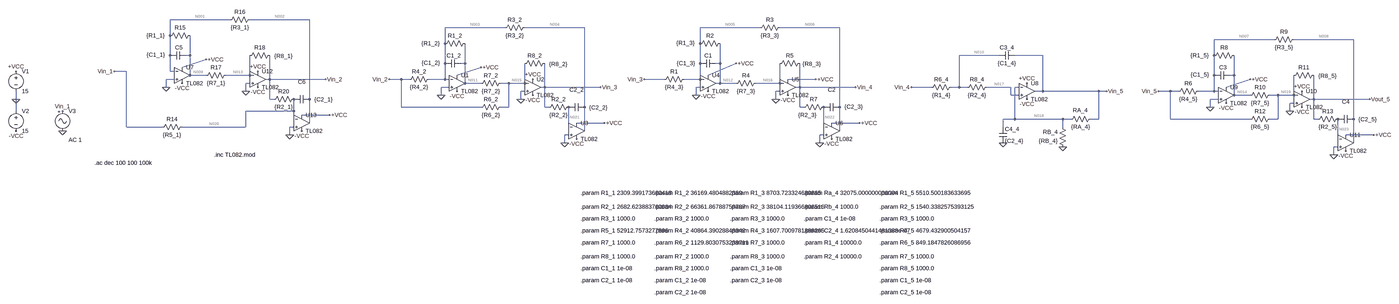
[diagram p0: schematic simulation_generated_20191112-203857.asc, whole sheet]
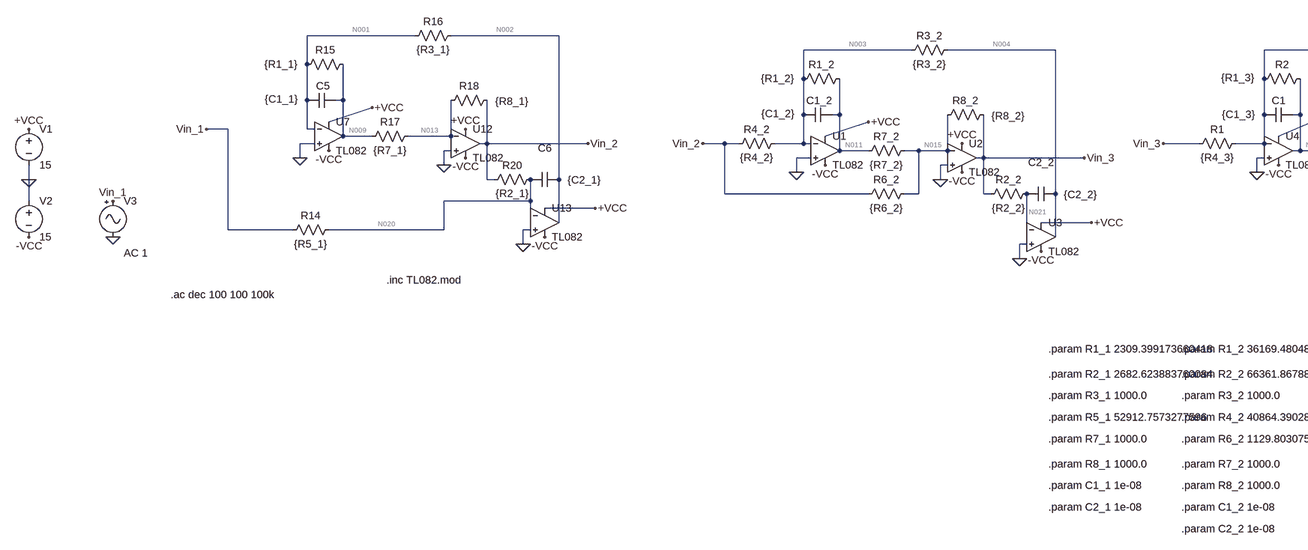
[diagram p1: schematic simulation_generated_20191112-203857.asc, part, row 1 of 1, column 1 of 2]
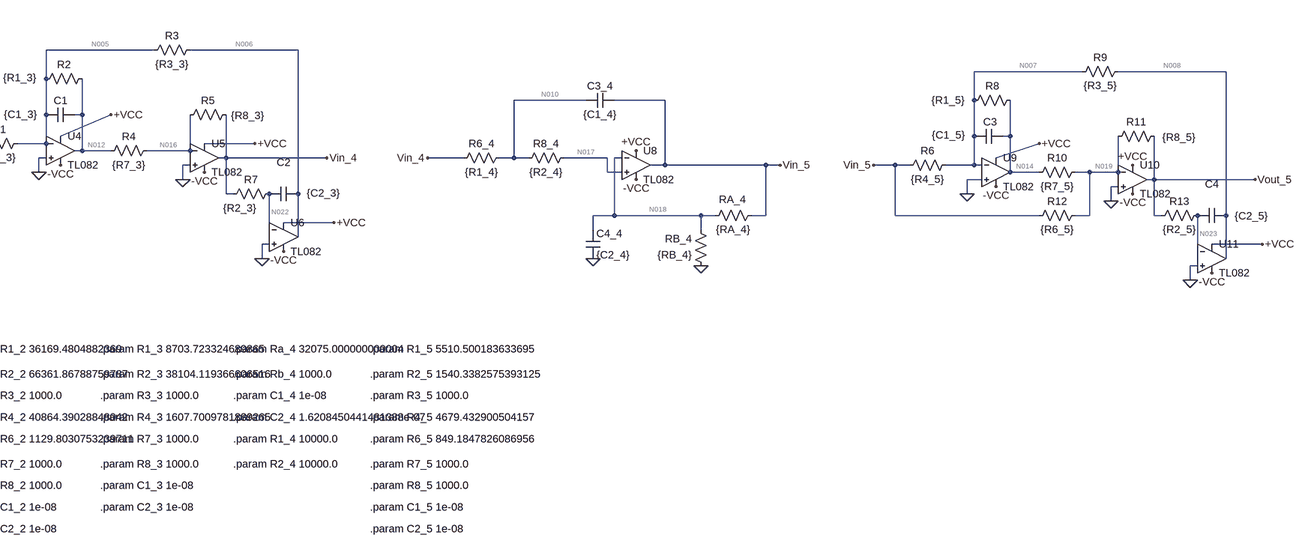
[diagram p2: schematic simulation_generated_20191112-203857.asc, part, row 1 of 1, column 2 of 2]
simulation_generated_20191112-203857.asc, the LTspice schematic file:
Version 4
SHEET 1 3956 1200
WIRE -768 -16 -1008 -16
WIRE -448 -16 -688 -16
WIRE 384 16 144 16
WIRE 704 16 464 16
WIRE 1408 16 1168 16
WIRE 1728 16 1488 16
WIRE -1008 48 -1008 -16
WIRE 3472 64 3232 64
WIRE 3792 64 3552 64
WIRE 144 80 144 16
WIRE 1168 80 1168 16
WIRE -1008 128 -1008 48
WIRE -928 128 -928 48
WIRE -928 128 -944 128
WIRE 2368 128 2208 128
WIRE 2544 128 2432 128
WIRE 3232 128 3232 64
WIRE 144 160 144 80
WIRE 224 160 224 80
WIRE 224 160 208 160
WIRE 1168 160 1168 80
WIRE 1248 160 1248 80
WIRE 1248 160 1232 160
WIRE -960 176 -864 144
WIRE -1184 192 -1232 192
WIRE -1008 192 -1008 128
WIRE -992 192 -1008 192
WIRE -928 208 -928 128
WIRE -864 208 -928 208
WIRE -688 208 -688 128
WIRE -688 208 -784 208
WIRE 192 208 288 176
WIRE 1200 208 1312 160
WIRE 3232 208 3232 128
WIRE 3312 208 3312 128
WIRE 3312 208 3296 208
WIRE -992 224 -1024 224
WIRE -608 224 -608 128
WIRE -608 224 -624 224
WIRE -384 224 -608 224
WIRE -32 224 -80 224
WIRE 0 224 -32 224
WIRE 144 224 144 160
WIRE 144 224 80 224
WIRE 160 224 144 224
WIRE 1024 224 944 224
WIRE 1168 224 1168 160
WIRE 1168 224 1104 224
WIRE 1632 224 1520 224
WIRE -688 240 -704 240
WIRE 224 240 224 160
WIRE 288 240 224 240
WIRE 400 240 368 240
WIRE 464 240 464 160
WIRE 464 240 400 240
WIRE 1248 240 1248 160
WIRE 1248 240 1232 240
WIRE 1312 240 1248 240
WIRE 1488 240 1488 160
WIRE 1488 240 1392 240
WIRE -1024 256 -1024 224
WIRE 160 256 128 256
WIRE 544 256 544 160
WIRE 544 256 528 256
WIRE 768 256 544 256
WIRE 1168 256 1152 256
WIRE 1568 256 1568 160
WIRE 1568 256 1552 256
WIRE 1792 256 1568 256
WIRE 2096 256 2016 256
WIRE 2208 256 2208 128
WIRE 2208 256 2176 256
WIRE 2240 256 2208 256
WIRE 2416 256 2320 256
WIRE 2448 256 2432 256
WIRE 3280 256 3376 224
WIRE -704 272 -704 240
WIRE 464 272 448 272
WIRE 1488 272 1472 272
WIRE 2544 272 2544 128
WIRE 2544 272 2512 272
WIRE 2768 272 2544 272
WIRE 2800 272 2768 272
WIRE 3056 272 3008 272
WIRE 3088 272 3056 272
WIRE 3232 272 3232 208
WIRE 3232 272 3168 272
WIRE 3248 272 3232 272
WIRE 128 288 128 256
WIRE 1152 288 1152 256
WIRE 2416 288 2416 256
WIRE 2448 288 2416 288
WIRE 3312 288 3312 208
WIRE 3376 288 3312 288
WIRE 3488 288 3456 288
WIRE 3552 288 3552 208
WIRE 3552 288 3488 288
WIRE -1792 304 -1792 272
WIRE -608 304 -608 224
WIRE -592 304 -608 304
WIRE -448 304 -448 -16
WIRE 448 304 448 272
WIRE 1472 304 1472 272
WIRE 3248 304 3216 304
WIRE 3632 304 3632 208
WIRE 3632 304 3616 304
WIRE 3856 304 3632 304
WIRE 3552 320 3536 320
WIRE -32 336 -32 224
WIRE 288 336 -32 336
WIRE 400 336 400 240
WIRE 400 336 368 336
WIRE 544 336 544 256
WIRE 560 336 544 336
WIRE 704 336 704 16
WIRE 1568 336 1568 256
WIRE 1584 336 1568 336
WIRE 1728 336 1728 16
WIRE 3216 336 3216 304
WIRE -1792 352 -1792 304
WIRE -512 352 -512 304
WIRE -512 352 -704 352
WIRE 3536 352 3536 320
WIRE -368 368 -480 368
WIRE -512 384 -512 352
WIRE 2432 384 2432 256
WIRE 2432 384 2384 384
WIRE 2624 384 2432 384
WIRE 2656 384 2624 384
WIRE 2768 384 2768 272
WIRE 2768 384 2736 384
WIRE 3056 384 3056 272
WIRE 3376 384 3056 384
WIRE 3488 384 3488 288
WIRE 3488 384 3456 384
WIRE 3632 384 3632 304
WIRE 3648 384 3632 384
WIRE 3792 384 3792 64
WIRE -448 400 -448 304
WIRE 784 400 672 400
WIRE 1808 400 1696 400
WIRE -1184 416 -1184 192
WIRE -1040 416 -1184 416
WIRE -704 416 -704 352
WIRE -704 416 -960 416
WIRE -512 416 -528 416
WIRE 640 416 640 336
WIRE 1664 416 1664 336
WIRE 2384 416 2384 384
WIRE 2624 416 2624 384
WIRE 704 432 704 336
WIRE 1728 432 1728 336
WIRE -528 448 -528 416
WIRE 640 448 624 448
WIRE 1664 448 1648 448
WIRE 3872 448 3760 448
WIRE 3728 464 3728 384
WIRE 624 480 624 448
WIRE 1648 480 1648 448
WIRE 3792 480 3792 384
WIRE 3728 496 3712 496
WIRE 3712 528 3712 496
FLAG 128 288 0
FLAG 448 304 0
FLAG 624 480 0
FLAG -80 224 Vin_2
FLAG 768 256 Vin_3
FLAG 1152 288 0
FLAG 1472 304 0
FLAG 1648 480 0
FLAG 944 224 Vin_3
FLAG 1792 256 Vin_4
FLAG 288 176 +VCC
FLAG 192 272 -VCC
FLAG 496 224 +VCC
FLAG 496 288 -VCC
FLAG 784 400 +VCC
FLAG 672 464 -VCC
FLAG 2384 480 0
FLAG 2624 496 0
FLAG 2480 240 +VCC
FLAG 2480 304 -VCC
FLAG 2016 256 Vin_4
FLAG 2800 272 Vin_5
FLAG 1312 160 +VCC
FLAG 1200 272 -VCC
FLAG 1632 224 +VCC
FLAG 1520 288 -VCC
FLAG 1808 400 +VCC
FLAG 1696 464 -VCC
FLAG 3216 336 0
FLAG 3536 352 0
FLAG 3712 528 0
FLAG 3008 272 Vin_5
FLAG 3856 304 Vout_5
FLAG 3376 224 +VCC
FLAG 3280 320 -VCC
FLAG 3584 272 +VCC
FLAG 3584 336 -VCC
FLAG 3872 448 +VCC
FLAG 3760 512 -VCC
FLAG -1024 256 0
FLAG -704 272 0
FLAG -528 448 0
FLAG -1232 192 Vin_1
FLAG -384 224 Vin_2
FLAG -864 144 +VCC
FLAG -960 240 -VCC
FLAG -656 192 +VCC
FLAG -656 256 -VCC
FLAG -368 368 +VCC
FLAG -480 432 -VCC
FLAG -1792 304 0
FLAG -1792 192 +VCC
FLAG -1792 432 -VCC
FLAG -1440 432 0
FLAG -1440 352 Vin_1
SYMBOL res 96 208 R90
WINDOW 0 0 56 VBottom 2
WINDOW 3 32 56 VTop 2
SYMATTR InstName R4_2
SYMATTR Value {R4_2}
SYMBOL res 240 64 R90
WINDOW 0 0 56 VBottom 2
WINDOW 3 0 154 VTop 2
SYMATTR InstName R1_2
SYMATTR Value {R1_2}
SYMBOL cap 208 144 R90
WINDOW 0 0 29 VBottom 2
WINDOW 3 -2 121 VTop 2
SYMATTR InstName C1_2
SYMATTR Value {C1_2}
SYMBOL res 480 0 R90
WINDOW 0 0 56 VBottom 2
WINDOW 3 32 56 VTop 2
SYMATTR InstName R3_2
SYMATTR Value {R3_2}
SYMBOL res 384 224 R90
WINDOW 0 0 56 VBottom 2
WINDOW 3 32 56 VTop 2
SYMATTR InstName R7_2
SYMATTR Value {R7_2}
SYMBOL res 560 144 R90
WINDOW 0 0 56 VBottom 2
WINDOW 3 3 -39 VTop 2
SYMATTR InstName R8_2
SYMATTR Value {R8_2}
SYMBOL res 384 320 R90
WINDOW 0 0 56 VBottom 2
WINDOW 3 32 56 VTop 2
SYMATTR InstName R6_2
SYMATTR Value {R6_2}
SYMBOL cap 704 320 R90
WINDOW 0 -38 32 VBottom 2
WINDOW 3 2 -56 VTop 2
SYMATTR InstName C2_2
SYMATTR Value {C2_2}
SYMBOL res 656 320 R90
WINDOW 0 0 56 VBottom 2
WINDOW 3 32 56 VTop 2
SYMATTR InstName R2_2
SYMATTR Value {R2_2}
SYMBOL res 1120 208 R90
WINDOW 0 0 56 VBottom 2
WINDOW 3 32 56 VTop 2
SYMATTR InstName R1
SYMATTR Value {R4_3}
SYMBOL res 1264 64 R90
WINDOW 0 0 56 VBottom 2
WINDOW 3 -2 154 VTop 2
SYMATTR InstName R2
SYMATTR Value {R1_3}
SYMBOL cap 1232 144 R90
WINDOW 0 0 32 VBottom 2
WINDOW 3 0 121 VTop 2
SYMATTR InstName C1
SYMATTR Value {C1_3}
SYMBOL res 1504 0 R90
WINDOW 0 0 56 VBottom 2
WINDOW 3 32 56 VTop 2
SYMATTR InstName R3
SYMATTR Value {R3_3}
SYMBOL res 1408 224 R90
WINDOW 0 0 56 VBottom 2
WINDOW 3 32 56 VTop 2
SYMATTR InstName R4
SYMATTR Value {R7_3}
SYMBOL res 1584 144 R90
WINDOW 0 0 56 VBottom 2
WINDOW 3 2 -32 VTop 2
SYMATTR InstName R5
SYMATTR Value {R8_3}
SYMBOL cap 1728 320 R90
WINDOW 0 -38 32 VBottom 2
WINDOW 3 -1 -57 VTop 2
SYMATTR InstName C2
SYMATTR Value {C2_3}
SYMBOL res 1680 320 R90
WINDOW 0 0 56 VBottom 2
WINDOW 3 32 81 VTop 2
SYMATTR InstName R7
SYMATTR Value {R2_3}
SYMBOL Opamps\\opamp2 192 176 R0
SYMATTR InstName U1
SYMATTR Value TL082
SYMBOL Opamps\\opamp2 496 192 R0
SYMATTR InstName U2
SYMATTR Value TL082
SYMBOL Opamps\\opamp2 672 368 R0
SYMATTR InstName U3
SYMATTR Value TL082
SYMBOL res 2192 240 R90
WINDOW 0 0 56 VBottom 2
WINDOW 3 32 56 VTop 2
SYMATTR InstName R6_4
SYMATTR Value {R1_4}
SYMBOL res 2336 240 R90
WINDOW 0 0 56 VBottom 2
WINDOW 3 32 56 VTop 2
SYMATTR InstName R8_4
SYMATTR Value {R2_4}
SYMBOL cap 2432 112 R90
WINDOW 0 0 32 VBottom 2
WINDOW 3 32 32 VTop 2
SYMATTR InstName C3_4
SYMATTR Value {C1_4}
SYMBOL res 2640 512 R180
WINDOW 0 36 76 Left 2
WINDOW 3 36 40 Left 2
SYMATTR InstName RB_4
SYMATTR Value {RB_4}
SYMBOL res 2752 368 R90
WINDOW 0 -4 58 VBottom 2
WINDOW 3 32 56 VTop 2
SYMATTR InstName RA_4
SYMATTR Value {RA_4}
SYMBOL cap 2368 416 R0
SYMATTR InstName C4_4
SYMATTR Value {C2_4}
SYMBOL Opamps\\opamp2 2480 208 R0
SYMATTR InstName U8
SYMATTR Value TL082
SYMBOL Opamps\\opamp2 1200 176 R0
SYMATTR InstName U4
SYMATTR Value TL082
SYMBOL Opamps\\opamp2 1520 192 R0
SYMATTR InstName U5
SYMATTR Value TL082
SYMBOL Opamps\\opamp2 1696 368 R0
SYMATTR InstName U6
SYMATTR Value TL082
SYMBOL res 3184 256 R90
WINDOW 0 0 56 VBottom 2
WINDOW 3 32 56 VTop 2
SYMATTR InstName R6
SYMATTR Value {R4_5}
SYMBOL res 3328 112 R90
WINDOW 0 0 56 VBottom 2
WINDOW 3 0 154 VTop 2
SYMATTR InstName R8
SYMATTR Value {R1_5}
SYMBOL cap 3296 192 R90
WINDOW 0 0 29 VBottom 2
WINDOW 3 -2 121 VTop 2
SYMATTR InstName C3
SYMATTR Value {C1_5}
SYMBOL res 3568 48 R90
WINDOW 0 0 56 VBottom 2
WINDOW 3 32 56 VTop 2
SYMATTR InstName R9
SYMATTR Value {R3_5}
SYMBOL res 3472 272 R90
WINDOW 0 0 56 VBottom 2
WINDOW 3 32 56 VTop 2
SYMATTR InstName R10
SYMATTR Value {R7_5}
SYMBOL res 3648 192 R90
WINDOW 0 0 56 VBottom 2
WINDOW 3 3 -39 VTop 2
SYMATTR InstName R11
SYMATTR Value {R8_5}
SYMBOL res 3472 368 R90
WINDOW 0 0 56 VBottom 2
WINDOW 3 32 56 VTop 2
SYMATTR InstName R12
SYMATTR Value {R6_5}
SYMBOL cap 3792 368 R90
WINDOW 0 -38 32 VBottom 2
WINDOW 3 2 -56 VTop 2
SYMATTR InstName C4
SYMATTR Value {C2_5}
SYMBOL res 3744 368 R90
WINDOW 0 0 56 VBottom 2
WINDOW 3 32 56 VTop 2
SYMATTR InstName R13
SYMATTR Value {R2_5}
SYMBOL Opamps\\opamp2 3280 224 R0
SYMATTR InstName U9
SYMATTR Value TL082
SYMBOL Opamps\\opamp2 3584 240 R0
SYMATTR InstName U10
SYMATTR Value TL082
SYMBOL Opamps\\opamp2 3760 416 R0
SYMATTR InstName U11
SYMATTR Value TL082
SYMBOL res -912 32 R90
WINDOW 0 0 56 VBottom 2
WINDOW 3 0 154 VTop 2
SYMATTR InstName R15
SYMATTR Value {R1_1}
SYMBOL cap -944 112 R90
WINDOW 0 0 29 VBottom 2
WINDOW 3 -2 121 VTop 2
SYMATTR InstName C5
SYMATTR Value {C1_1}
SYMBOL res -672 -32 R90
WINDOW 0 0 56 VBottom 2
WINDOW 3 32 56 VTop 2
SYMATTR InstName R16
SYMATTR Value {R3_1}
SYMBOL res -768 192 R90
WINDOW 0 0 56 VBottom 2
WINDOW 3 32 56 VTop 2
SYMATTR InstName R17
SYMATTR Value {R7_1}
SYMBOL res -592 112 R90
WINDOW 0 0 56 VBottom 2
WINDOW 3 3 -39 VTop 2
SYMATTR InstName R18
SYMATTR Value {R8_1}
SYMBOL cap -448 288 R90
WINDOW 0 -38 32 VBottom 2
WINDOW 3 2 -56 VTop 2
SYMATTR InstName C6
SYMATTR Value {C2_1}
SYMBOL res -496 288 R90
WINDOW 0 0 56 VBottom 2
WINDOW 3 32 56 VTop 2
SYMATTR InstName R20
SYMATTR Value {R2_1}
SYMBOL Opamps\\opamp2 -960 144 R0
SYMATTR InstName U7
SYMATTR Value TL082
SYMBOL Opamps\\opamp2 -656 160 R0
SYMATTR InstName U12
SYMATTR Value TL082
SYMBOL Opamps\\opamp2 -480 336 R0
SYMATTR InstName U13
SYMATTR Value TL082
SYMBOL res -944 400 R90
WINDOW 0 0 56 VBottom 2
WINDOW 3 32 56 VTop 2
SYMATTR InstName R14
SYMATTR Value {R5_1}
SYMBOL voltage -1792 176 R0
WINDOW 123 0 0 Left 2
WINDOW 39 0 0 Left 2
SYMATTR InstName V1
SYMATTR Value 15
SYMBOL voltage -1792 336 R0
WINDOW 123 0 0 Left 2
WINDOW 39 0 0 Left 2
SYMATTR InstName V2
SYMATTR Value 15
SYMBOL Misc\\signal -1440 336 R0
WINDOW 123 24 132 Left 2
WINDOW 39 0 0 Left 2
SYMATTR Value2 AC 1
SYMATTR InstName V3
SYMATTR Value ""
TEXT -832 528 Left 2 !.inc TL082.mod
TEXT -1312 560 Left 2 !.ac dec 100 100 100k
TEXT 688 784 Left 2 !.param R1_1 2309.399173660418
TEXT 688 840 Left 2 !.param R2_1 2682.623883760084
TEXT 688 888 Left 2 !.param R3_1 1000.0
TEXT 688 936 Left 2 !.param R5_1 52912.7573277596
TEXT 688 984 Left 2 !.param R7_1 1000.0
TEXT 688 1040 Left 2 !.param R8_1 1000.0
TEXT 688 1088 Left 2 !.param C1_1 1e-08
TEXT 688 1136 Left 2 !.param C2_1 1e-08
TEXT 984 784 Left 2 !.param R1_2 36169.4804882369
TEXT 984 840 Left 2 !.param R2_2 66361.86788759787
TEXT 984 888 Left 2 !.param R3_2 1000.0
TEXT 984 936 Left 2 !.param R4_2 40864.39028848042
TEXT 984 984 Left 2 !.param R6_2 1129.8030753239711
TEXT 984 1040 Left 2 !.param R7_2 1000.0
TEXT 984 1088 Left 2 !.param R8_2 1000.0
TEXT 984 1136 Left 2 !.param C1_2 1e-08
TEXT 984 1184 Left 2 !.param C2_2 1e-08
TEXT 1288 784 Left 2 !.param R1_3 8703.723324689865
TEXT 1288 840 Left 2 !.param R2_3 38104.119366606516
TEXT 1288 888 Left 2 !.param R3_3 1000.0
TEXT 1288 936 Left 2 !.param R4_3 1607.7009781889265
TEXT 1288 984 Left 2 !.param R7_3 1000.0
TEXT 1288 1040 Left 2 !.param R8_3 1000.0
TEXT 1288 1088 Left 2 !.param C1_3 1e-08
TEXT 1288 1136 Left 2 !.param C2_3 1e-08
TEXT 1584 784 Left 2 !.param Ra_4 32075.000000000004
TEXT 1584 840 Left 2 !.param Rb_4 1000.0
TEXT 1584 888 Left 2 !.param C1_4 1e-08
TEXT 1584 936 Left 2 !.param C2_4 1.6208450441481388e-07
TEXT 1584 984 Left 2 !.param R1_4 10000.0
TEXT 1584 1040 Left 2 !.param R2_4 10000.0
TEXT 1888 784 Left 2 !.param R1_5 5510.500183633695
TEXT 1888 840 Left 2 !.param R2_5 1540.3382575393125
TEXT 1888 888 Left 2 !.param R3_5 1000.0
TEXT 1888 936 Left 2 !.param R4_5 4679.432900504157
TEXT 1888 984 Left 2 !.param R6_5 849.1847826086956
TEXT 1888 1040 Left 2 !.param R7_5 1000.0
TEXT 1888 1088 Left 2 !.param R8_5 1000.0
TEXT 1888 1136 Left 2 !.param C1_5 1e-08
TEXT 1888 1184 Left 2 !.param C2_5 1e-08

The netlist it stands for:
* simulation_generated_20191112-203857.asc
R4_2 N003 Vin_2 {R4_2}
R1_2 N011 N003 {R1_2}
C1_2 N011 N003 {C1_2}
R3_2 N004 N003 {R3_2}
R7_2 N015 N011 {R7_2}
R8_2 Vin_3 N015 {R8_2}
R6_2 N015 Vin_2 {R6_2}
C2_2 N004 N021 {C2_2}
R2_2 N021 Vin_3 {R2_2}
R1 N005 Vin_3 {R4_3}
R2 N012 N005 {R1_3}
C1 N012 N005 {C1_3}
R3 N006 N005 {R3_3}
R4 N016 N012 {R7_3}
R5 Vin_4 N016 {R8_3}
C2 N006 N022 {C2_3}
R7 N022 Vin_4 {R2_3}
XU1 0 N003 +VCC -VCC N011 TL082  ; pins In+ In- V+ V- OUT
XU2 0 N015 +VCC -VCC Vin_3 TL082  ; pins In+ In- V+ V- OUT
XU3 0 N021 +VCC -VCC N004 TL082  ; pins In+ In- V+ V- OUT
R6_4 N010 Vin_4 {R1_4}
R8_4 N017 N010 {R2_4}
C3_4 Vin_5 N010 {C1_4}
RB_4 0 N018 {RB_4}
RA_4 Vin_5 N018 {RA_4}
C4_4 N018 0 {C2_4}
XU8 N017 N018 +VCC -VCC Vin_5 TL082  ; pins In+ In- V+ V- OUT
XU4 0 N005 +VCC -VCC N012 TL082  ; pins In+ In- V+ V- OUT
XU5 0 N016 +VCC -VCC Vin_4 TL082  ; pins In+ In- V+ V- OUT
XU6 0 N022 +VCC -VCC N006 TL082  ; pins In+ In- V+ V- OUT
R6 N007 Vin_5 {R4_5}
R8 N014 N007 {R1_5}
C3 N014 N007 {C1_5}
R9 N008 N007 {R3_5}
R10 N019 N014 {R7_5}
R11 Vout_5 N019 {R8_5}
R12 N019 Vin_5 {R6_5}
C4 N008 N023 {C2_5}
R13 N023 Vout_5 {R2_5}
XU9 0 N007 +VCC -VCC N014 TL082  ; pins In+ In- V+ V- OUT
XU10 0 N019 +VCC -VCC Vout_5 TL082  ; pins In+ In- V+ V- OUT
XU11 0 N023 +VCC -VCC N008 TL082  ; pins In+ In- V+ V- OUT
R15 N009 N001 {R1_1}
C5 N009 N001 {C1_1}
R16 N002 N001 {R3_1}
R17 N013 N009 {R7_1}
R18 Vin_2 N013 {R8_1}
C6 N002 N020 {C2_1}
R20 N020 Vin_2 {R2_1}
XU7 0 N001 +VCC -VCC N009 TL082  ; pins In+ In- V+ V- OUT
XU12 0 N013 +VCC -VCC Vin_2 TL082  ; pins In+ In- V+ V- OUT
XU13 0 N020 +VCC -VCC N002 TL082  ; pins In+ In- V+ V- OUT
R14 N020 Vin_1 {R5_1}
V1 +VCC 0 15
V2 0 -VCC 15
V3 Vin_1 0 AC 1
.inc TL082.mod
.ac dec 100 100 100k
.param R1_1 2309.399173660418
.param R2_1 2682.623883760084
.param R3_1 1000.0
.param R5_1 52912.7573277596
.param R7_1 1000.0
.param R8_1 1000.0
.param C1_1 1e-08
.param C2_1 1e-08
.param R1_2 36169.4804882369
.param R2_2 66361.86788759787
.param R3_2 1000.0
.param R4_2 40864.39028848042
.param R6_2 1129.8030753239711
.param R7_2 1000.0
.param R8_2 1000.0
.param C1_2 1e-08
.param C2_2 1e-08
.param R1_3 8703.723324689865
.param R2_3 38104.119366606516
.param R3_3 1000.0
.param R4_3 1607.7009781889265
.param R7_3 1000.0
.param R8_3 1000.0
.param C1_3 1e-08
.param C2_3 1e-08
.param Ra_4 32075.000000000004
.param Rb_4 1000.0
.param C1_4 1e-08
.param C2_4 1.6208450441481388e-07
.param R1_4 10000.0
.param R2_4 10000.0
.param R1_5 5510.500183633695
.param R2_5 1540.3382575393125
.param R3_5 1000.0
.param R4_5 4679.432900504157
.param R6_5 849.1847826086956
.param R7_5 1000.0
.param R8_5 1000.0
.param C1_5 1e-08
.param C2_5 1e-08
.backanno
.end

* Results of the author's LTspice run, read from the files saved beside the schematic
* Operating Point, zero values left out:
*   V(n003) = 10.97 µV
*   V(vin_2) = 11.65 µV
*   V(n011) = 7.427 µV
*   V(n004) = 11.1 µV
*   V(n015) = 10.97 µV
*   V(vin_3) = 13.96 µV
*   V(n021) = 10.97 µV
*   V(n005) = 10.97 µV
*   V(n012) = 9.299 µV
*   V(n006) = 9.348 µV
*   V(n016) = 10.97 µV
*   V(vin_4) = 12.69 µV
*   V(n022) = 10.97 µV
*   V(-vcc) = -15 V
*   V(+vcc) = 15 V
*   V(n010) = 12.24 µV
*   V(n017) = 11.79 µV
*   V(vin_5) = 754 µV
*   V(n018) = 22.75 µV
*   V(n007) = 10.98 µV
*   V(n014) = -864 µV
*   V(n008) = 11.03 µV
*   V(n019) = 10.97 µV
*   V(vout_5) = 11.04 µV
*   V(n023) = 10.97 µV
*   V(n009) = 10.34 µV
*   V(n001) = 10.97 µV
*   V(n002) = 11.29 µV
*   V(n013) = 10.97 µV
*   V(n020) = 10.97 µV
*   I(R14) = 207.3 pA
*   I(R20) = -252.4 pA
*   I(R18) = 677.1 pA
*   I(R17) = 632 pA
*   I(R16) = 318.7 pA
*   I(R15) = -273.7 pA
*   I(R13) = -45.05 pA
*   I(R12) = -875 nA
*   I(R11) = 69.4 pA
*   I(R10) = 875 nA
*   I(R9) = 51.51 pA
*   I(R8) = -158.8 nA
*   I(R6) = -158.8 nA
*   I(Ra_4) = 22.8 nA
*   I(Rb_4) = -22.75 nA
*   I(R8_4) = -45.05 pA
*   I(R6_4) = -45.05 pA
*   I(R7) = -45.05 pA
*   I(R5) = 1.717 nA
*   I(R4) = 1.672 nA
*   I(R3) = -1.623 nA
*   I(R2) = -192.1 pA
*   I(R1) = -1.86 nA
*   I(R2_2) = -45.05 pA
*   I(R6_2) = -599.3 pA
*   I(R8_2) = 2.99 nA
*   I(R7_2) = 3.544 nA
*   I(R3_2) = 126.5 pA
*   I(R1_2) = -97.99 pA
*   I(R4_2) = -16.57 pA
*   I(V3) = 207.3 pA
*   I(V2) = -184.5 mA
*   I(V1) = -184.5 mA
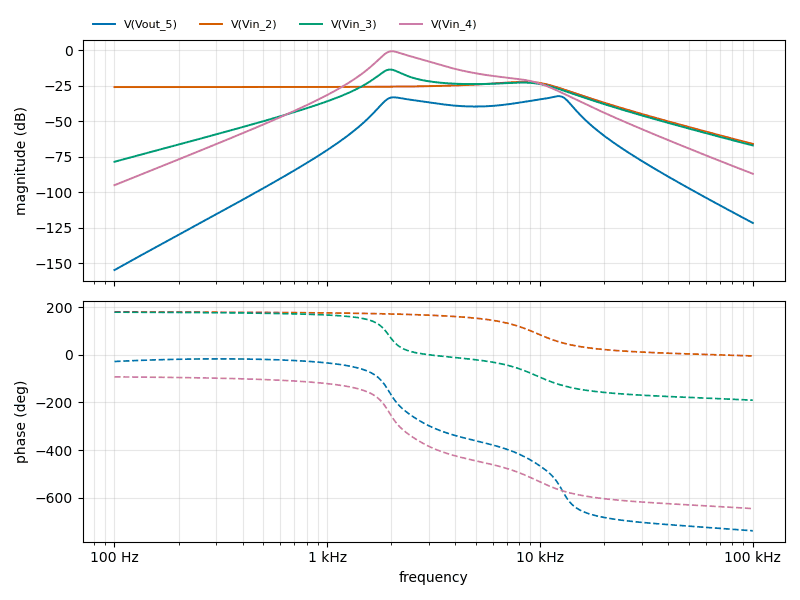
[diagram p3: AC Analysis of simulation_generated_20191112-203857.asc, plotted from the saved traces]
* AC Analysis, 1 run:
*   V(Vout_5): -154.84 dB at 100 Hz, -121.64 dB at 100 kHz, peak -32.28 dB at 12.3 kHz, 3 dB below the peak at 9.37 kHz and 13.39 kHz
*   V(Vin_2): -25.90 dB at 100 Hz, -65.95 dB at 100 kHz, peak -22.16 dB at 8.511 kHz, 3 dB below the peak at 3.2 kHz and 11.5 kHz
*   V(Vin_3): -78.52 dB at 100 Hz, -67.04 dB at 100 kHz, peak -13.57 dB at 1.995 kHz, 3 dB below the peak at 1.783 kHz and 2.251 kHz
*   V(Vin_4): -95.05 dB at 100 Hz, -86.97 dB at 100 kHz, peak -0.68 dB at 1.995 kHz, 3 dB below the peak at 1.827 kHz and 2.398 kHz